# EAGLE board csa_petio_v1.2b (EAGLE 6.4)
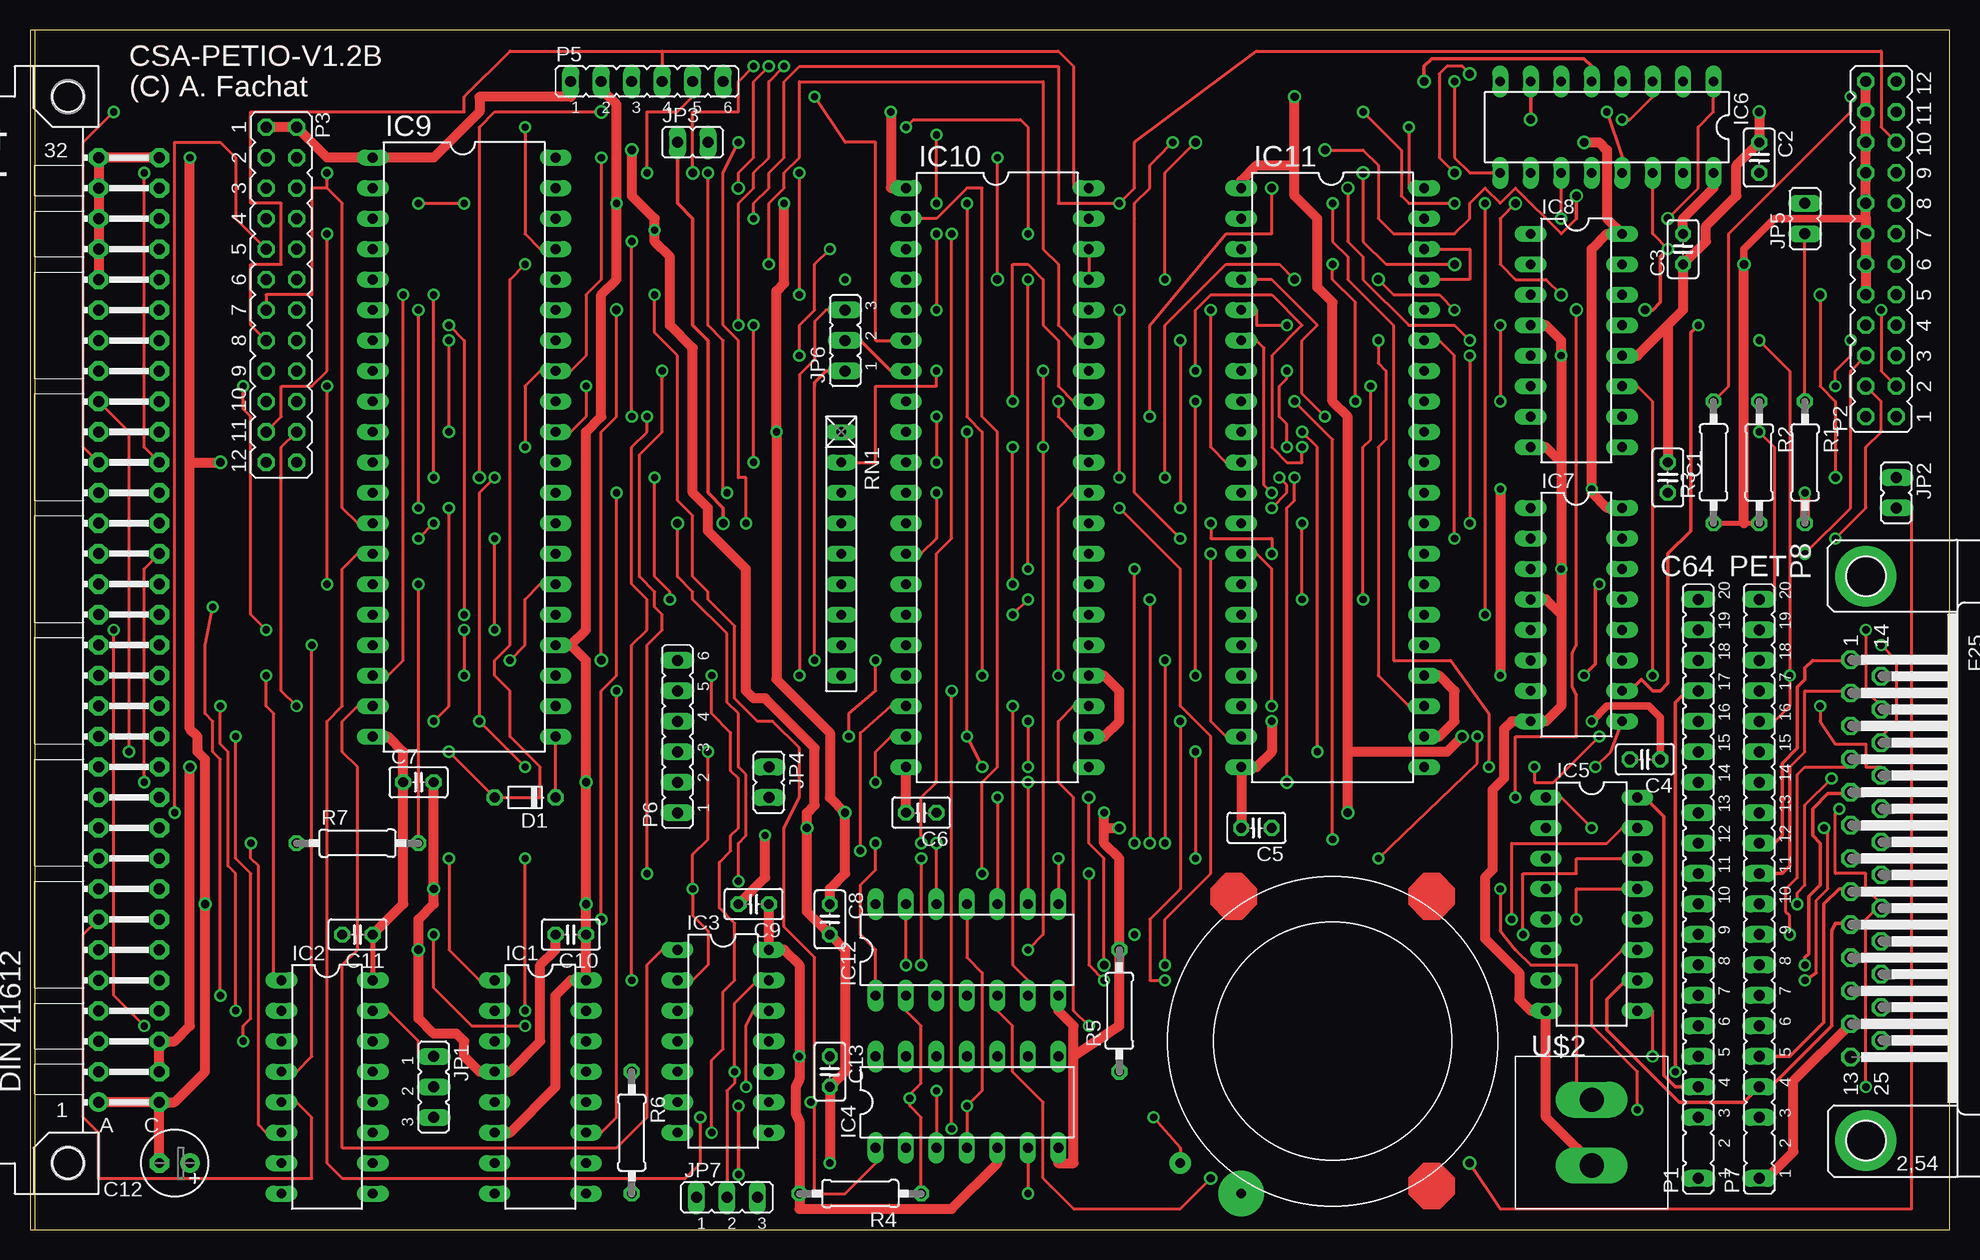
[diagram p2: board, top side]
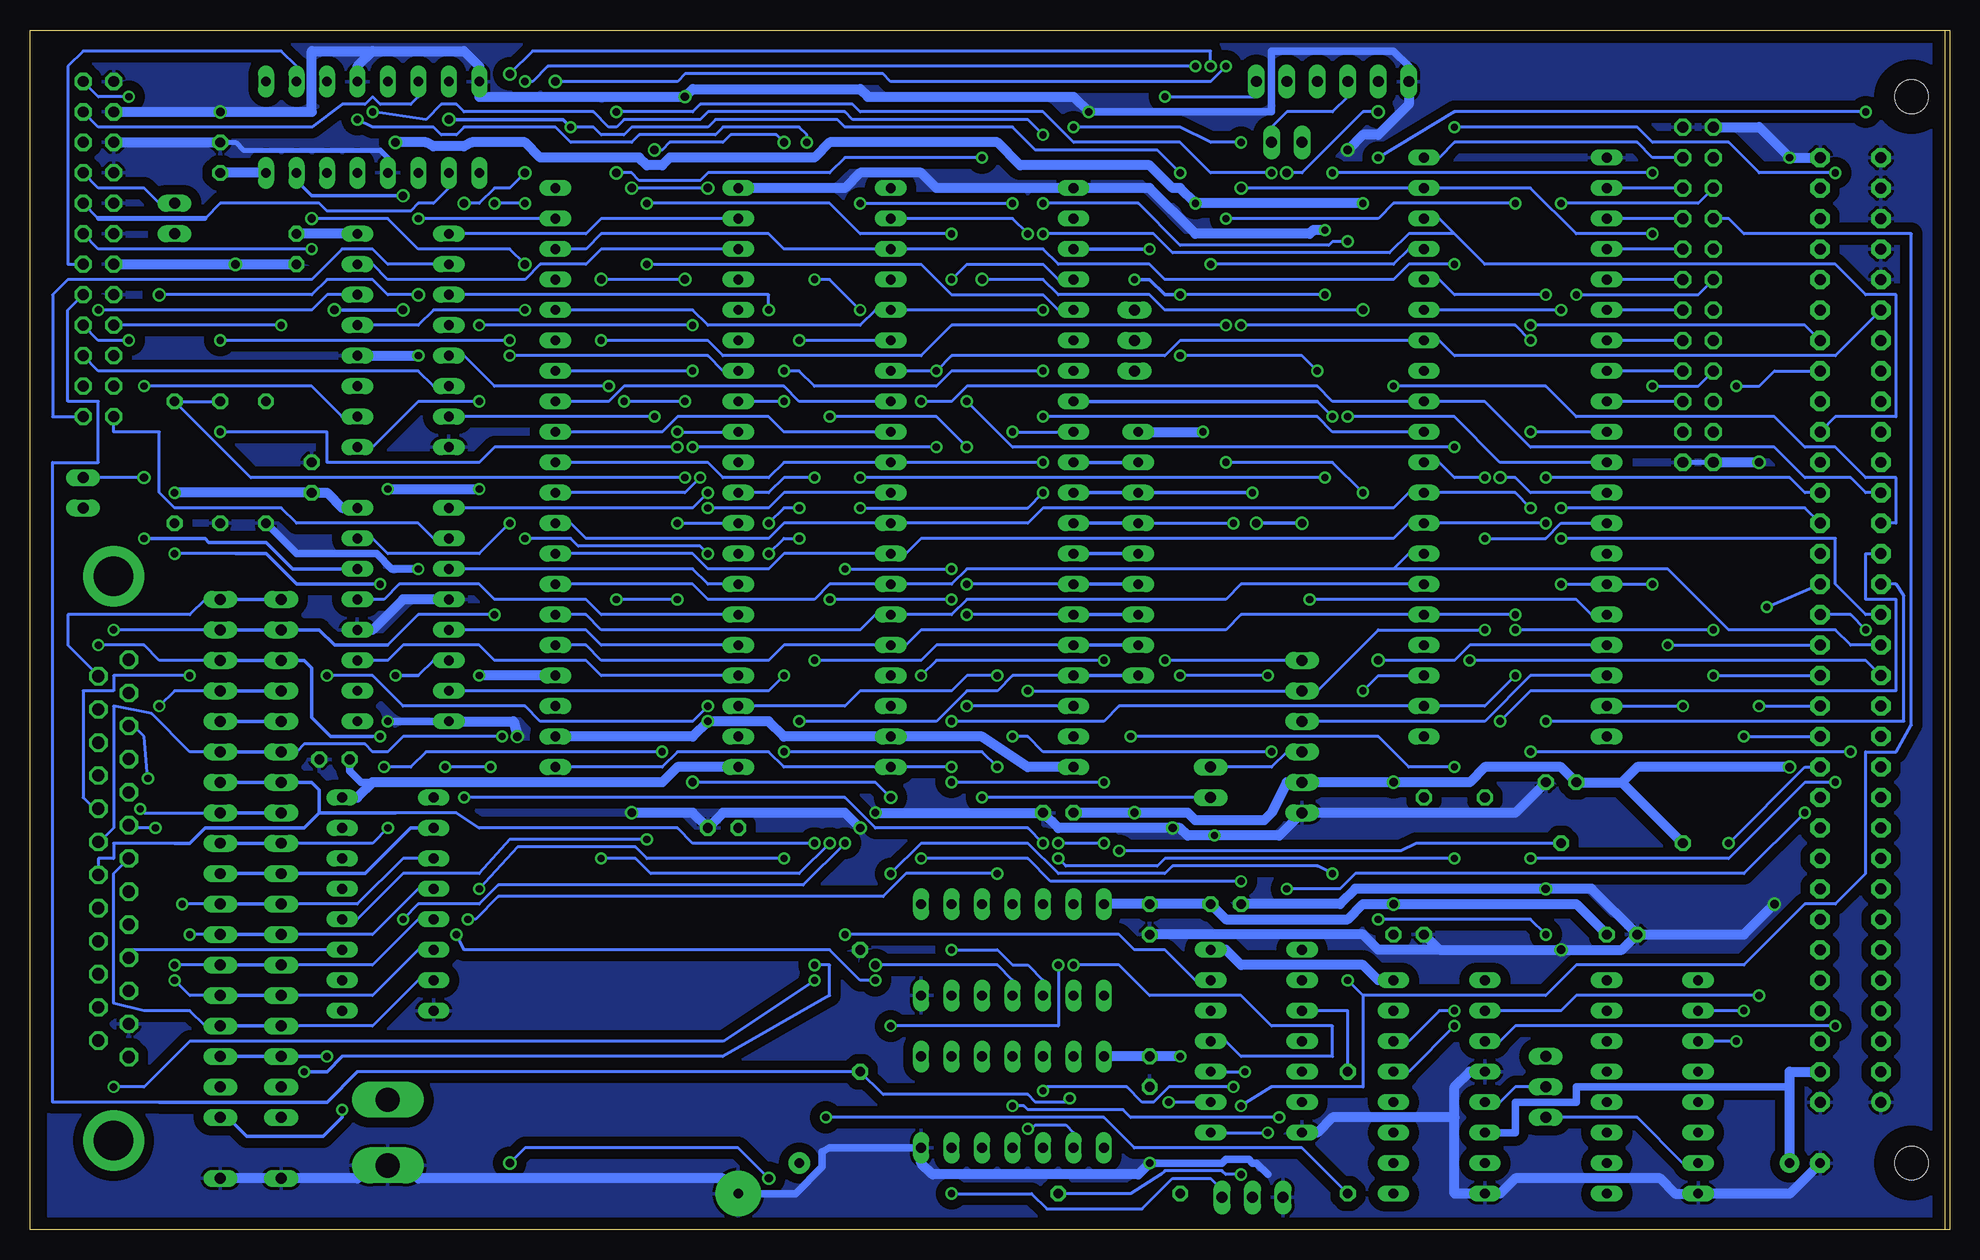
[diagram p3: board, bottom side, seen from below]

Size 160 x 100.03 mm. Coordinates in mm from the lower left corner, seen from the top.
Outline: 0,0.01 160,0.01 160,100.01 0,100.01 0,0.01
Copper layers (1*16): Top 0.035mm / dielectric 1.5mm / Bottom 0.035mm
Design rules "default *": minimum track width 10mil, minimum drill 12mil, track to track 8mil, track to pad 8mil, pad to pad 8mil, via to via 8mil, smd to smd 8mil, copper to edge 40mil, drill to drill 8mil, minimum pad ring 10mil, minimum via ring 8mil, stop-mask expansion 4mil, vias tented up to drill 0mil, thermal gap 10mil

## Footprints (pad centres in the part's own frame; a part is rotated, then mirrored left to right if it is on the bottom)
PIEZOBEEPER = drill 0.8 pad 1.778: 1 -10.16,12.7 | drill 0.8 pad 3.81: 2 -12.7,7.62
C025-025X050 = drill 0.813 octagon: 1 -1.27,0; 2 1.27,0
E2,5-6 = drill 0.813 pad 1.6: + -1.27,0 | drill 0.813 pad 1.6 octagon: - 1.27,0
D-5 = drill 0.813 octagon: A 2.54,0; C -2.54,0
DIL16 = drill 0.813 long: 1 -8.89,-3.81; 2 -6.35,-3.81; 3 -3.81,-3.81; 4 -1.27,-3.81; 5 1.27,-3.81; 6 3.81,-3.81; 7 6.35,-3.81; 8 8.89,-3.81; 9 8.89,3.81; 10 6.35,3.81; 11 3.81,3.81; 12 1.27,3.81; 13 -1.27,3.81; 14 -3.81,3.81; 15 -6.35,3.81; 16 -8.89,3.81
DIL14 = drill 0.813 long: 1 -7.62,-3.81; 2 -5.08,-3.81; 3 -2.54,-3.81; 4 0,-3.81; 5 2.54,-3.81; 6 5.08,-3.81; 7 7.62,-3.81; 8 7.62,3.81; 9 5.08,3.81; 10 2.54,3.81; 11 0,3.81; 12 -2.54,3.81; 13 -5.08,3.81; 14 -7.62,3.81
DIL40 = drill 0.813 long: 1 -16.51,-7.62; 2 -13.97,-7.62; 3 -11.43,-7.62; 4 -8.89,-7.62; 5 -6.35,-7.62; 6 -3.81,-7.62; 7 -1.27,-7.62; 8 1.27,-7.62; 9 3.81,-7.62; 10 6.35,-7.62; 11 8.89,-7.62; 12 11.43,-7.62; 13 13.97,-7.62; 14 16.51,-7.62; 15 19.05,-7.62; 16 21.59,-7.62; 17 24.13,-7.62; 18 26.67,-7.62; 19 29.21,-7.62; 20 31.75,-7.62; 21 31.75,7.62; 22 29.21,7.62; 23 26.67,7.62; 24 24.13,7.62; 25 21.59,7.62; 26 19.05,7.62; 27 16.51,7.62; 28 13.97,7.62; 29 11.43,7.62; 30 8.89,7.62; 31 6.35,7.62; 32 3.81,7.62; 33 1.27,7.62; 34 -1.27,7.62; 35 -3.81,7.62; 36 -6.35,7.62; 37 -8.89,7.62; 38 -11.43,7.62; 39 -13.97,7.62; 40 -16.51,7.62
JP2 = drill 0.914 long: 1 -2.54,0; 2 0,0; 3 2.54,0
JP1 = drill 0.914 long: 1 0,-1.27; 2 0,1.27
C64KEYB = drill 0.914 long: 1 0,0; 3 5.08,0; 4 7.62,0; 5 10.16,0; 6 12.7,0; 7 15.24,0; 8 17.78,0; 9 20.32,0; 10 22.86,0; 11 25.4,0; 12 27.94,0; 13 30.48,0; 14 33.02,0; 15 35.56,0; 16 38.1,0; 17 40.64,0; 18 43.18,0; 19 45.72,0; 20 48.26,0
FLAT24 = drill 0.914 octagon: 1 -13.97,-1.27; 2 -11.43,-1.27; 3 -8.89,-1.27; 4 -6.35,-1.27; 5 -3.81,-1.27; 6 -1.27,-1.27; 7 1.27,-1.27; 8 3.81,-1.27; 9 6.35,-1.27; 10 8.89,-1.27; 11 11.43,-1.27; 12 13.97,-1.27; A -13.97,1.27; B -11.43,1.27; C -8.89,1.27; D -6.35,1.27; E -3.81,1.27; F -1.27,1.27; H 1.27,1.27; J 3.81,1.27; K 6.35,1.27; L 8.89,1.27; M 11.43,1.27; N 13.97,1.27
CSABUS = drill 0.914 pad 1.6: A1 7.62,36.83 | drill 0.914 pad 1.6 octagon: A2 7.62,34.29; A3 7.62,31.75; A4 7.62,29.21; A5 7.62,26.67; A6 7.62,24.13; A7 7.62,21.59; A8 7.62,19.05; A9 7.62,16.51; A10 7.62,13.97; A11 7.62,11.43; A12 7.62,8.89; A13 7.62,6.35; A14 7.62,3.81; A15 7.62,1.27; A16 7.62,-1.27; A17 7.62,-3.81; A18 7.62,-6.35; A19 7.62,-8.89; A20 7.62,-11.43; A21 7.62,-13.97; A22 7.62,-16.51; A23 7.62,-19.05; A24 7.62,-21.59; A25 7.62,-24.13; A26 7.62,-26.67; A27 7.62,-29.21; A28 7.62,-31.75; A29 7.62,-34.29; A30 7.62,-36.83; A31 7.62,-39.37; A32 7.62,-41.91; C1 2.54,36.83; C2 2.54,34.29; C3 2.54,31.75; C4 2.54,29.21; C5 2.54,26.67; C6 2.54,24.13; C7 2.54,21.59; C8 2.54,19.05; C9 2.54,16.51; C10 2.54,13.97; C11 2.54,11.43; C12 2.54,8.89; C13 2.54,6.35; C14 2.54,3.81; C15 2.54,1.27; C16 2.54,-1.27; C17 2.54,-3.81; C18 2.54,-6.35; C19 2.54,-8.89; C20 2.54,-11.43; C21 2.54,-13.97; C22 2.54,-16.51; C23 2.54,-19.05; C24 2.54,-21.59; C25 2.54,-24.13; C26 2.54,-26.67; C27 2.54,-29.21; C28 2.54,-31.75; C29 2.54,-34.29; C30 2.54,-36.83; C31 2.54,-39.37; C32 2.54,-41.91 | hole 2.794: 10.16,41.91; 10.16,-46.99
JP6 = drill 0.914 long: 1 -7.62,1.27; 2 -5.08,1.27; 3 -2.54,1.27; 4 0,1.27; 5 2.54,1.27; 6 5.08,1.27
SUBD25F = drill 1.016 octagon: 1 -14.021,-10.16; 2 -11.252,-10.16; 3 -8.509,-10.16; 4 -5.74,-10.16; 5 -2.972,-10.16; 6 -0.229,-10.16; 7 2.54,-10.16; 8 5.309,-10.16; 9 8.052,-10.16; 10 10.82,-10.16; 11 13.589,-10.16; 12 16.332,-10.16; 13 19.101,-10.16; 14 -12.649,-7.62; 15 -9.881,-7.62; 16 -7.112,-7.62; 17 -4.369,-7.62; 18 -1.6,-7.62; 19 1.168,-7.62; 20 3.912,-7.62; 21 6.68,-7.62; 22 9.449,-7.62; 23 12.192,-7.62; 24 14.961,-7.62; 25 17.729,-7.62 | drill 3.302 pad 5.08: G1 -20.98,-8.89; G2 26.06,-8.89
0207/10 = drill 0.813 octagon: 1 -5.08,0; 2 5.08,0
RN-9 = drill 0.813 long: 1 -10.16,0; 2 -7.62,0; 3 -5.08,0; 4 -2.54,0; 5 0,0; 6 2.54,0; 7 5.08,0; 8 7.62,0; 9 10.16,0
TASTER = drill 2.007 long: 1 0,4.013; 3 0,-1.473

## Placement (x,y rotation side)
BEEP1  PIEZOBEEPERPIEZO  [PIEZOBEEPER]  108.58,15.72 90 top
C1  [C025-025X050]  136.52,62.71 270 top
C2  [C025-025X050]  144.14,89.38 270 top
C3  [C025-025X050]  137.79,81.76 90 top
C4  [C025-025X050]  134.62,39.22 180 top
C5  [C025-025X050]  102.23,33.5 180 top
C6  [C025-025X050]  74.29,34.77 180 top
C7  [C025-025X050]  32.38,37.31 0 top
C8  [C025-025X050]  66.67,25.88 270 top
C9  [C025-025X050]  60.32,27.15 180 top
C10  [C025-025X050]  45.08,24.61 180 top
C11  [C025-025X050]  27.3,24.61 180 top
C12  [E2,5-6]  12.06,5.56 180 top
C13  [C025-025X050]  66.67,13.18 270 top
D1  [D-5]  41.27,36.04 180 top
IC1  74HCT138N  [DIL16]  42.54,11.91 270 top
IC2  74HCT138N  [DIL16]  24.76,11.91 270 top
IC3  74HCT00N  [DIL14]  57.78,15.72 270 top
IC4  74LS86N  [DIL14]  78.1,10.64 0 top
IC5  74LS145N  [DIL16]  130.17,27.15 270 top
IC6  MC3446  [DIL16]  131.44,91.92 180 top
IC7  MC3446  [DIL16]  128.9,51.28 270 top
IC8  MC3446  [DIL16]  128.9,74.14 270 top
IC9  VIA  [DIL40]  36.19,72.87 270 top
IC10  PIA  [DIL40]  80.64,70.33 270 top
IC11  PIA  [DIL40]  108.58,70.33 270 top
IC12  7417N  [DIL14]  78.1,23.34 0 top
JP1  [JP2]  33.65,11.91 270 top
JP2  [JP1]  155.57,61.44 180 top
JP3  [JP1]  55.24,90.65 270 top
JP4  [JP1]  61.59,37.31 180 top
JP5  [JP1]  147.95,84.3 0 top
JP6  [JP2]  67.94,74.14 90 top
JP7  [JP2]  58.1,2.71 0 top
P1  C64KEYB  [C64KEYB]  139.06,4.29 90 top
P2  IEEE488FLATCABLE  [FLAT24]  154.3,81.76 90 top
P3  PETUSERPORT  [FLAT24]  20.95,77.95 270 top
P4  CSABUS  [CSABUS]  13.33,47.47 180 top
P5  CBMTAPE  [JP6]  52.7,94.46 0 top
P6  CBMTAPE  [JP6]  55.24,42.39 90 top
P7  PETKEYBD  [C64KEYB]  144.14,4.29 90 top
P8  PETKEYBDSUBD  [SUBD25F]  161.92,33.5 270 top
R1  2k4  [0207/10]  147.95,63.98 270 top
R2  5k1  [0207/10]  144.14,63.98 270 top
R3  2k4  [0207/10]  140.33,63.98 90 top
R4  2k4  [0207/10]  69.21,3.02 180 top
R5  5k1  [0207/10]  90.8,18.26 90 top
R6  10  [0207/10]  50.16,8.1 270 top
R7  10k  [0207/10]  27.3,32.23 0 top
RN1  10k  [RN-9]  67.62,56.36 270 top
U$2  TASTER  [TASTER]  130.17,6.83 0 top

## Tracks (layer width: path | path; a pad name or v marks a point on that pad's centre or on a via)
//C2MTR  (via drill 0.6)
  Top 0.254: IC4.6 v83.18,3.02
  Bottom 0.254: v83.18,3.02 76.51,3.02 75.24,1.75 67.3,1.75 66.99,2.07 64.77,4.29 61.59,4.29 60.64,3.34 JP7.3
/C1MTR  (via drill 0.6, 0.61)
  Top 0.254: v70.48,37.31 70.48,39.85 71.75,41.12 IC10.19 | v83.18,37.31 IC12.9
  Bottom 0.254: v70.48,37.31 v83.18,37.31
/C2MTR  (via drill 0.6)
  Top 0.254: IC9.14 27.3,56.36 26.03,55.09 26.03,43.66 24.76,42.39 24.76,5.56 26.03,4.29 54.61,4.29 55.88,5.56 v55.88,9.37 | IC4.4 v78.1,10.32 79.37,11.6 79.37,21.44 78.1,22.71 IC12.11
  Bottom 0.254: v55.88,9.37 68.26,9.37 68.89,10.01 76.83,10.01 77.15,10.32 v78.1,10.32
/IOSEL
  Top 0.254: P4.A7 4.44,24.61 4.44,9.37 5.71,8.1 5.71,4.29 23.49,4.29 23.49,9.37 22.22,10.64 IC2.5
/IRQ  (via drill 0.61)
  Top 0.254: IC10.38 IC10.37 | IC11.38 120.01,81.76 120.01,79.22 IC11.37 | v8.25,39.85 8.25,66.52 P4.A24 | v41.27,80.49 40,79.22 40,48.74 38.73,47.47 38.73,46.2 40,44.93 40,41.12 42.54,38.58 42.54,36.04 D1.A v34.92,39.85
  Bottom 0.254: IC11.38 113.66,81.76 112.39,83.03 98.42,83.03 97.15,81.76 IC10.38 75.56,81.76 74.29,80.49 66.67,80.49 65.4,79.22 46.35,79.22 45.08,80.49 v41.27,80.49 | v8.25,39.85 v34.92,39.85
/RES  (via drill 0.61)
  Top 0.254: v83.18,23.34 84.45,24.61 v84.45,65.25 v84.45,71.6 | v104.77,65.25 104.77,67.16 104.13,67.79 104.13,70.33 104.77,70.97 v104.77,71.6
  Bottom 0.254: P4.A27 9.52,72.87 41.27,72.87 42.54,74.14 IC9.34 64.13,74.14 65.4,72.87 83.18,72.87 v84.45,71.6 IC10.34 | v83.18,23.34 79.37,23.34 78.1,22.07 76.83,22.07 75.56,20.8 IC12.3 | v84.45,65.25 v104.77,65.25 | v104.77,71.6 IC11.34
/SEL1  (via drill 0.61)
  Top 0.254: v41.27,18.26 v41.27,30.96 | v74.29,30.96 v74.29,22.07 | v88.26,16.99 86.99,18.26 86.99,36.04 85.72,37.31 85.72,42.39 86.99,43.66 IC10.23
  Bottom 0.254: v41.27,18.26 42.54,18.26 45.08,15.72 IC1.14 | v41.27,30.96 65.4,30.96 66.03,30.33 73.66,30.33 v74.29,30.96 | v74.29,22.07 74.29,16.99 v88.26,16.99
/SEL2  (via drill 0.61)
  Top 0.254: v41.27,16.99 36.83,16.99 33.65,20.17 v33.65,24.61 | v47.62,25.88 47.62,44.93 48.89,46.2 v48.89,61.44 | v60.32,63.98 v60.32,75.41 | v112.39,74.14 112.39,72.24 113.02,71.6 113.02,65.89 112.39,65.25 112.39,46.2 114.93,43.66 IC11.23
  Bottom 0.254: v41.27,16.99 45.08,13.18 IC1.13 | v33.65,24.61 34.92,25.88 v47.62,25.88 | v48.89,61.44 51.43,63.98 v60.32,63.98 | v60.32,75.41 83.18,75.41 85.72,72.87 102.23,72.87 103.5,74.14 v112.39,74.14
/SEL4  (via drill 0.61)
  Top 0.254: v48.89,44.93 48.89,9.37 47.62,8.1 IC1.11
  Bottom 0.254: v48.89,44.93 47.62,46.2 IC9.23
/SRQIN  (via drill 0.61)
  Top 0.254: v78.1,85.57 78.1,67.79 79.37,66.52 v79.37,46.2 | P2.10 154.3,91.92 154.3,98.27 102.23,98.27 92.07,90.65 92.07,86.84 v90.8,85.57 85.72,85.57 85.72,97 64.13,97 62.86,95.73 62.86,89.38 61.59,88.11 61.59,86.84 60.32,85.57 v60.32,84.3 | v32.38,85.57 v36.19,85.57
  Bottom 0.254: v79.37,46.2 81.91,46.2 83.18,44.93 90.8,44.93 92.07,43.66 IC11.18 | v90.8,85.57 v78.1,85.57 | P3.3 20.95,85.57 v32.38,85.57 | v36.19,85.57 46.35,85.57 47.62,84.3 v60.32,84.3
A0  (via drill 0.61)
  Top 0.254: v75.56,83.03 v75.56,76.68
  Bottom 0.254: IC11.36 104.77,76.68 103.5,75.41 90.8,75.41 89.53,76.68 IC10.36 v75.56,76.68 | 41.27,83.03 38.73,80.49 9.52,80.49 6.98,77.95 4.44,77.95 4.44,67.79 9.52,67.79 P4.C23 | 41.27,83.03 42.54,84.3 IC9.38 | 41.27,83.03 45.08,83.03 46.67,81.45 64.77,81.45 66.35,83.03 v75.56,83.03
A1  (via drill 0.61)
  Top 0.254: v61.59,80.49 61.59,85.57 62.86,86.84 62.86,88.11 64.13,89.38 64.13,95.73 84.45,95.73 84.45,81.76 85.72,80.49 85.72,75.41 86.99,74.14 IC10.35 | v118.74,57.63 118.74,72.87 117.47,74.14 IC11.35 | v103.5,56.36 103.5,57.63 98.42,57.63 v98.42,58.9 | v95.88,74.14 v95.88,60.17 | P4.C22 9.52,65.25 v9.52,88.11 | v41.27,91.92 41.27,83.03 42.54,81.76 IC9.37
  Bottom 0.254: IC9.37 45.08,81.76 46.35,80.49 v61.59,80.49 | v118.74,57.63 114.93,57.63 114.3,57 104.13,57 v103.5,56.36 | v98.42,58.9 97.15,60.17 v95.88,60.17 | IC10.35 v95.88,74.14 | v9.52,88.11 15.87,88.11 18.41,90.65 24.76,90.65 26.03,91.92 v41.27,91.92
A2  (via drill 0.61)
  Top 0.254: v33.65,62.71 v33.65,77.95
  Bottom 0.254: v33.65,77.95 41.27,77.95 42.54,79.22 IC9.36 | v33.65,62.71 13.33,62.71 12.06,61.44 P4.C21
A3  (via drill 0.61)
  Top 0.254: v32.38,60.17 v32.38,76.68
  Bottom 0.254: v32.38,60.17 12.06,60.17 P4.C20 | v32.38,76.68 IC9.35
A4  (via drill 0.61)
  Top 0.254: v34.92,30.96 34.92,23.34 37.46,20.8 IC1.1 | v9.52,37.31 9.52,55.09 P4.C19
  Bottom 0.254: v34.92,30.96 18.41,30.96 12.06,37.31 v9.52,37.31
A5  (via drill 0.61)
  Top 0.254: v15.87,19.53 15.87,39.22 15.24,39.85 15.24,42.39 14.6,43.03 14.6,48.74 v15.24,51.92
  Bottom 0.254: v15.87,19.53 31.11,19.53 32.38,18.26 IC1.2 | v15.24,51.92 P4.C18
A6  (via drill 0.61)
  Top 0.254: v9.52,16.99 6.98,19.53 v6.98,50.01
  Bottom 0.254: v9.52,16.99 36.19,16.99 37.46,15.72 IC1.3 | v6.98,50.01 8.25,51.28 P4.C17
A7  (via drill 0.61)
  Top 0.254: v23.49,48.74 23.49,14.45 22.22,13.18 IC2.4
  Bottom 0.254: v23.49,48.74 P4.C16
A8  (via drill 0.61)
  Top 0.254: v19.68,46.2 19.68,43.66 20.31,43.03 20.31,21.44 IC2.1
  Bottom 0.254: v19.68,46.2 P4.C15
A9  (via drill 0.61)
  Top 0.254: v17.14,18.26 17.14,29.69 16.5,30.33 16.5,39.85 15.87,40.49 v15.87,43.66
  Bottom 0.254: v15.87,43.66 P4.C14 | v17.14,18.26 IC2.2
A10  (via drill 0.61)
  Top 0.254: v17.77,15.72 17.77,16.99 18.41,17.63 18.41,29.69 17.14,30.96 v17.14,41.12
  Bottom 0.254: v17.14,41.12 P4.C13 | v17.77,15.72 IC2.3
A11  (via drill 0.61)
  Top 0.254: v18.41,32.23 18.41,30.96 19.04,30.33 19.04,8.74 19.68,8.1 IC2.6
  Bottom 0.254: v18.41,32.23 12.06,38.58 P4.C12
ATN
  Bottom 0.254: P2.11 154.3,91.92 136.52,91.92 133.98,93.83 132.07,93.83 131.44,94.46 130.81,93.83 128.27,93.83 127.63,94.46 IC6.6
ATN/C2SW
  Top 0.305: JP6.2 69.21,74.14 71.75,71.6 IC10.7
ATNA_EN  (via drill 0.6, 0.61)
  Top 0.254: IC3.13 60.64,20.8 58.73,18.9 v58.73,13.18 58.73,12.23 58.1,11.6 JP7.2
  Bottom 0.254: v92.07,24.61 69.21,24.61 67.94,23.34 65.4,23.34 62.86,20.8 IC3.13 | IC3.10 v58.73,13.18
ATNIN  (via drill 0.6, 0.61, 0.7)
  Top 0.254: 65.4,10.32 65.4,3.02 67.94,3.02 70.48,5.56 IC4.1 | 65.4,10.32 65.4,22.71 62.86,25.25 62.86,33.5 64.13,36.04 64.13,40.17 61.91,42.39 60.64,42.39 58.73,44.3 58.73,50.33 56.51,52.55 56.51,53.19 55.24,54.46 55.24,59.54 53.97,60.81 53.97,72.87 52.07,74.78 v52.07,77.95 | v64.13,77.95 v64.13,88.11 | v114.93,91.92 114.93,86.84 IC11.40 | v65.08,10.64 65.4,10.32
  Top 0.305: IC6.7 v125.09,92.56
  Bottom 0.254: v52.07,77.95 v64.13,77.95 | v64.13,88.11 66.03,90.02 76.19,90.02 78.1,91.92 92.07,91.92 92.7,92.56 102.86,92.56 103.5,91.92 109.85,91.92 110.48,91.29 112.39,91.29 113.02,91.92 v114.93,91.92 | IC3.9 v65.08,10.64
  Bottom 0.305: v125.09,92.56 115.56,92.56 v114.93,91.92 | v64.13,77.95 65.4,77.95 66.67,79.22 v67.94,79.22
ATNOUT  (via drill 0.61, 0.7)
  Top 0.254: v37.46,62.71 37.46,91.92 38.73,93.19 v47.62,93.19 | v55.24,88.11 55.24,93.19 59.05,93.19 59.05,95.73 v60.32,97
  Top 0.305: IC6.5 130.17,97 129.53,97.64 116.83,97.64 116.2,97 v116.2,95.73
  Bottom 0.254: v60.32,97 61.59,95.73 88.26,95.73 88.89,96.37 105.41,96.37 106.04,95.73 v116.2,95.73 | IC9.12 34.92,61.44 36.19,62.71 v37.46,62.71 | v47.62,93.19 48.89,93.19 53.97,88.11 v55.24,88.11
C1MTR
  Bottom 0.254: P5.3 50.16,94.46 51.43,93.19 55.24,93.19 56.51,91.92 JP3.2
C1RD
  Top 0.254: 52.7,98.27 85.72,98.27 86.99,97 86.99,86.84 IC10.40 | 52.7,98.27 P5.4 | P3.8 18.41,75.41 18.41,80.49 20.95,80.49 20.95,85.57 18.41,85.57 18.41,93.19 36.19,93.19 36.19,94.46 40,98.27 52.7,98.27
C1SW  (via drill 0.61)
  Top 0.254: IC10.6 70.48,74.14 70.48,90.65 67.94,90.65 v65.4,94.46
  Bottom 0.254: v65.4,94.46 57.78,94.46 P5.6
C2MTR
  Bottom 0.254: P6.3 55.24,39.85 56.51,38.58 JP4.1
C2RD  (via drill 0.61)
  Top 0.254: v31.11,77.95 31.11,47.47 29.84,46.2 IC9.18
  Bottom 0.254: IC9.18 34.92,46.2 38.73,42.39 P6.4 | P3.6 20.95,77.95 v31.11,77.95
C2SW  (via drill 0.61)
  Top 0.254: v65.4,47.47 65.4,70.33
  Top 0.305: 65.4,70.33 65.4,70.65 66.35,71.6 JP6.1
  Bottom 0.254: P6.6 v65.4,47.47
CWR  (via drill 0.6, 0.61)
  Top 0.254: v76.83,8.42 v76.83,44.93 | 24.76,86.84 26.03,85.57 26.03,60.17 27.3,58.9 IC9.13 | 24.76,86.84 23.49,86.84 23.49,77.95 19.68,77.95 P3.7 | 24.76,86.84 v24.76,88.11 | v51.43,88.11 51.43,93.19 53.97,93.19 55.24,94.46 P5.5 | v38.73,50.01 v38.73,57.63
  Bottom 0.254: v76.83,44.93 P6.5 52.7,44.93 47.62,50.01 v38.73,50.01 | v24.76,88.11 v51.43,88.11 | v38.73,57.63 33.65,57.63 32.38,58.9 IC9.13 | v76.83,8.42 76.51,8.42 76.19,8.74 73.66,8.74 73.02,8.1 IC4.2
D0  (via drill 0.61)
  Top 0.254: v47.62,89.38 47.62,79.22 46.35,77.95 46.35,72.87 45.08,71.6 IC9.33 42.54,71.6 41.27,70.33 v41.27,65.25 | v6.98,93.19 4.44,90.65 4.44,65.25 P4.A22 | v81.91,69.06 81.91,80.49 83.18,80.49 84.45,79.22 84.45,75.41 85.72,74.14 85.72,70.33 86.99,69.06 IC10.33
  Bottom 0.254: IC10.33 95.88,69.06 97.15,70.33 110.48,70.33 111.75,69.06 IC11.33 | v47.62,89.38 41.27,93.19 v6.98,93.19 | v81.91,69.06 78.1,65.25 v41.27,65.25
D1  (via drill 0.61)
  Top 0.254: v85.72,69.06 85.72,67.79 86.99,66.52 IC10.32
  Bottom 0.254: IC10.32 97.15,66.52 98.42,67.79 106.04,67.79 107.31,66.52 IC11.32 | P4.A21 6.98,61.44 8.25,62.71 12.06,62.71 14.6,65.25 34.92,65.25 38.73,69.06 IC9.32 51.43,69.06 52.7,70.33 81.91,70.33 83.18,69.06 v85.72,69.06
D2  (via drill 0.61)
  Top 0.254: v46.35,70.33 46.35,67.79 45.08,66.52 IC9.31 | v75.56,67.79 v75.56,63.98
  Bottom 0.254: IC11.31 103.5,63.98 102.23,62.71 98.42,62.71 97.15,63.98 IC10.31 v75.56,63.98 | v46.35,70.33 33.65,70.33 31.11,67.79 14.6,67.79 12.06,65.25 9.52,65.25 6.98,62.71 4.44,62.71 4.44,58.9 P4.A20 | v75.56,67.79 52.7,67.79 51.43,66.52 IC9.31
D3  (via drill 0.61)
  Top 0.254: v103.5,60.17 104.77,61.44 104.77,62.08 v104.13,62.71 | v38.73,62.71 37.46,61.44 v37.46,42.39 v41.27,38.58 | v85.72,46.2 85.72,60.17 86.99,61.44 IC10.30 | v70.48,47.47 70.48,44.93 68.26,43.03 v68.26,41.12
  Bottom 0.254: v103.5,60.17 98.42,60.17 97.15,61.44 IC10.30 | v104.13,62.71 105.41,61.44 IC11.30 | v38.73,62.71 41.27,62.71 42.54,63.98 IC9.30 | v37.46,42.39 34.92,44.93 4.44,44.93 4.44,52.55 6.98,52.55 6.98,56.36 P4.A19 | v85.72,46.2 84.45,47.47 v70.48,47.47 | v68.26,41.12 47.62,41.12 45.08,38.58 v41.27,38.58
D4  (via drill 0.61)
  Top 0.254: v33.65,42.39 34.92,43.66 v34.92,60.17
  Bottom 0.254: IC11.29 114.93,58.9 113.66,57.63 98.42,57.63 97.15,58.9 IC10.29 76.83,58.9 75.56,60.17 46.35,60.17 45.08,61.44 IC9.29 36.19,61.44 v34.92,60.17 | P4.A18 4.44,53.82 3.8,52.87 3.8,42.39 v33.65,42.39
D5  (via drill 0.61)
  Top 0.254: v32.38,57.63 v33.65,58.9
  Bottom 0.254: IC11.28 104.77,56.36 103.5,55.09 98.42,55.09 97.15,56.36 IC10.28 86.99,56.36 85.72,57.63 46.35,57.63 45.08,58.9 IC9.28 v33.65,58.9 | P4.A17 6.98,51.28 9.52,53.82 9.52,57.63 v32.38,57.63
D6
  Bottom 0.254: 46.35,55.09 45.08,56.36 IC9.27 | 46.35,55.09 81.91,55.09 83.18,53.82 IC10.27 93.34,53.82 94.61,52.55 103.5,52.55 104.77,53.82 IC11.27 | P4.A16 8.25,48.74 9.52,50.01 18.41,50.01 23.49,55.09 46.35,55.09
D7  (via drill 0.61)
  Top 0.254: v40,47.47 41.27,48.74 41.27,52.55 42.54,53.82 IC9.26
  Bottom 0.254: IC11.26 113.66,51.28 112.39,50.01 90.8,50.01 89.53,51.28 IC10.26 83.18,51.28 81.91,52.55 60.32,52.55 59.05,53.82 IC9.26 | P4.A15 6.98,47.47 v40,47.47
DAV
  Bottom 0.254: P2.6 156.84,80.49 156.84,97 155.57,98.27 139.06,98.27 137.79,97 IC6.2
DAVIN  (via drill 0.61, 0.7)
  Top 0.254: IC6.1 140.33,93.19 139.06,91.92 139.06,86.84 v136.52,84.3 | v118.74,80.49 113.02,80.49 111.12,82.4 v111.12,88.11 | v47.62,47.47 47.62,66.52 48.89,67.79 v48.89,76.68 | v80.64,79.22 v80.64,89.38
  Bottom 0.254: v136.52,84.3 130.17,84.3 127.63,81.76 120.01,81.76 v118.74,80.49 | v111.12,88.11 109.85,88.11 109.21,87.48 104.13,87.48 103.5,88.11 93.34,88.11 92.07,89.38 v80.64,89.38 | IC9.17 40,48.74 41.27,47.47 v47.62,47.47 | v48.89,76.68 65.4,76.68 66.67,77.95 74.29,77.95 75.56,79.22 v80.64,79.22
DAVOUT  (via drill 0.61)
  Top 0.254: v98.42,56.36 98.42,42.39 99.69,41.12 IC11.19 | v95.88,57.63 92.07,61.44 92.07,84.3 92.07,85.57 93.34,86.84 93.34,88.75 93.97,89.38 v95.24,90.65 | v132.71,92.56 133.34,92.56 135.25,94.46 IC6.3
  Bottom 0.254: v98.42,56.36 97.15,57.63 v95.88,57.63 | v95.24,90.65 95.24,91.29 95.88,91.92 102.23,91.92 102.86,91.29 109.21,91.29 109.85,90.65 114.93,90.65 116.2,91.92 123.82,91.92 124.45,91.29 125.72,91.29 126.36,91.92 131.44,91.92 v132.71,92.56
DEC0  (via drill 0.61)
  Top 0.254: v130.17,33.5 127.63,36.04 IC5.1 | 148.59,47.47 151.76,47.47 P8.1
  Top 0.305: P7.12 145.41,32.23 146.04,32.87 146.04,38.9 147.31,40.17 147.31,45.25 147.95,45.89 147.95,46.84 148.59,47.47
  Bottom 0.254: v130.17,33.5 131.44,32.23 P1.12
  Bottom 0.305: P7.12 P1.12
DEC1
  Top 0.254: 146.68,38.58 147.95,39.85 147.95,44.93 151.76,44.93 P8.2
  Top 0.305: 146.68,38.58 146.68,30.33 146.04,29.69 P7.11
  Bottom 0.305: P7.11 P1.11 132.07,29.69 128.27,33.5 IC5.2
DEC2  (via drill 0.61)
  Top 0.254: v147.31,27.15 147.31,28.1 147.95,28.74 147.95,35.41 v150.17,37.63
  Bottom 0.254: IC5.3 128.9,30.96 132.71,27.15 P1.10 | v150.17,37.63 150.49,41.12 151.76,42.39 P8.3 | P7.10 v147.31,27.15
  Bottom 0.305: P7.10 P1.10
DEC3  (via drill 0.61)
  Top 0.254: v146.68,24.61 146.68,26.2 146.36,26.52 146.36,28.42 147.31,29.37 147.31,37.95 147.95,38.58 151.76,38.58 P8.4
  Bottom 0.254: IC5.4 127.63,28.42 131.44,24.61 P1.9 | P7.9 v146.68,24.61
  Bottom 0.305: P7.9 P1.9
DEC4  (via drill 0.61)
  Top 0.305: v147.95,22.07 147.95,22.71 148.27,23.03 148.27,27.79 149.22,28.74 149.22,32.23 148.59,32.87 148.59,35.09 149.85,36.36 151.65,36.36 P8.5
  Bottom 0.254: IC5.5 127.63,25.88 131.44,22.07 P1.8 | P7.8 v147.95,22.07
  Bottom 0.305: P7.8 P1.8
DEC5  (via drill 0.61)
  Top 0.254: v149.54,33.5 149.85,33.19 149.85,28.42 148.9,27.47 148.9,21.44 v147.95,20.8
  Bottom 0.254: IC5.6 127.63,23.34 131.44,19.53 P1.7 | v149.54,33.5 151.76,33.5 P8.6 | v147.95,20.8 146.68,19.53 P7.7
  Bottom 0.305: P7.7 P1.7
DEC6
  Bottom 0.254: IC5.7 127.63,20.8 131.44,16.99 P1.6 | P8.7 153.03,29.69 153.03,18.9 150.49,18.26 146.68,18.26 145.41,16.99 P7.6
  Bottom 0.305: P7.6 P1.6
DEC7  (via drill 0.61)
  Top 0.254: v135.25,14.45 135.25,18.26 IC5.9
  Top 0.305: P7.5 146.68,14.45 149.54,17.31 149.54,27.15 150.81,28.42 151.53,28.42 P8.8
  Bottom 0.254: 151.76,28.42 P8.8
  Bottom 0.305: P7.5 P1.5 v135.25,14.45
DEC8
  Top 0.305: IC5.10 133.03,20.8 131.44,19.22 131.44,16.67 137.47,10.64 142.87,10.64 P7.4 145.09,11.91 150.17,16.99 150.17,24.93 150.49,25.56 151.65,25.56 P8.9
  Bottom 0.254: 151.76,25.88 P8.9
DEC9  (via drill 0.61)
  Top 0.254: v133.98,10.01 133.98,13.18 130.17,16.99 130.17,20.8 132.71,23.34 IC5.11
  Bottom 0.254: P8.10 151.76,23.34 IC5.11
  Bottom 0.305: P7.3 143.5,9.37 141.92,7.79 135.57,7.79 133.98,9.37 v133.98,10.01
DI1
  Bottom 0.254: IC11.2 112.39,84.3 113.66,83.03 IC8.1
DI2
  Bottom 0.254: IC11.3 112.39,81.76 113.66,80.49 117.47,80.49 118.74,79.22 130.17,79.22 131.44,80.49 IC8.15
DI3  (via drill 0.61)
  Top 0.254: v107.94,67.79 106.04,69.7 106.04,74.14 107.31,75.41 103.5,79.22 IC11.4
  Bottom 0.254: v107.94,67.79 IC8.7
DI4  (via drill 0.61)
  Top 0.254: v122.55,75.41 v122.55,69.06 | v104.77,75.41 102.23,75.41 102.23,76.68 IC11.5
  Bottom 0.254: v122.55,69.06 127.63,69.06 131.44,65.25 IC8.9 | v104.77,75.41 v122.55,75.41
DI5  (via drill 0.61)
  Top 0.254: v103.5,61.44 102.86,62.08 102.86,73.51 102.23,74.14 IC11.6
  Bottom 0.254: v103.5,61.44 104.77,60.17 IC7.1
DI6  (via drill 0.61)
  Top 0.254: v120.01,72.87 v120.01,58.9
  Bottom 0.254: v120.01,72.87 103.5,72.87 102.23,71.6 IC11.7 | v120.01,58.9 122.55,56.36 130.17,56.36 131.44,57.63 IC7.15
DI7  (via drill 0.61)
  Top 0.254: v97.15,46.2 v97.15,69.06
  Bottom 0.254: v97.15,46.2 98.42,44.93 IC7.7 | v97.15,69.06 IC11.8
DI8  (via drill 0.61)
  Top 0.254: v106.04,66.52 107.31,65.25 v107.31,39.85 | v130.49,38.58 131.76,39.85 IC7.9
  Bottom 0.254: v107.31,39.85 126.99,39.85 128.27,38.58 v130.49,38.58 | v106.04,66.52 IC11.9
DIAG  (via drill 0.61)
  Top 0.254: v56.51,39.85 56.51,32.55 55.24,31.28 v55.24,28.42 55.24,26.2 56.51,24.93 56.51,22.07 55.24,20.8 IC3.2 | v78.1,66.52 v78.1,41.12 v79.37,38.58 | P3.5 17.14,84.3 17.14,89.38 15.87,90.65 12.06,90.65 v12.06,34.77 | v122.55,28.42 122.55,24.93 123.82,23.34 125.09,22.07 128.9,22.07 128.9,11.91 U$2.1 | v97.15,39.85 v97.15,30.96
  Bottom 0.254: v56.51,39.85 75.56,39.85 76.83,41.12 v78.1,41.12 | v78.1,66.52 IC10.9 | v12.06,34.77 17.14,29.69 49.53,29.69 50.8,28.42 v55.24,28.42 | v122.55,28.42 119.38,31.92 109.53,31.92 108.58,30.96 v97.15,30.96 | v97.15,39.85 80.64,39.85 v79.37,38.58
DIO1
  Bottom 0.254: P2.1 158.11,67.79 158.11,77.95 156.84,79.22 136.52,79.22 133.98,81.76 131.44,81.76 130.17,80.49 IC8.2
DIO2  (via drill 0.61)
  Top 0.254: v154.3,76.68 154.3,71.6 P2.2
  Bottom 0.254: v154.3,76.68 136.52,76.68 135.25,77.95 IC8.14
DIO3
  Bottom 0.254: P2.3 154.3,71.6 127.63,71.6 126.36,70.33 IC8.6
DIO4  (via drill 0.61)
  Top 0.254: v150.49,70.33 150.49,71.6 151.76,72.87 v151.76,74.14
  Bottom 0.254: v150.49,70.33 136.52,70.33 133.98,67.79 IC8.10 | v151.76,74.14 154.3,74.14 P2.4
DIO5
  Bottom 0.254: P2.A 153.03,66.52 149.22,66.52 149.22,61.44 147.95,60.17 139.06,60.17 137.79,58.9 127.63,58.9 126.36,57.63 IC7.2
DIO6  (via drill 0.61)
  Top 0.254: v150.49,57.63 153.03,60.17 153.03,65.25 154.3,66.52 154.3,69.06 P2.B
  Bottom 0.254: IC7.14 133.98,55.09
  Bottom 0.305: 133.98,55.09 138.11,55.09 140.33,57.32 145.09,57.32 145.41,57.63 v150.49,57.63
DIO7  (via drill 0.6, 0.61)
  Top 0.254: v147.95,56.36 151.76,60.17 151.76,71.6 P2.C
  Top 0.305: v129.53,46.2 130.49,47.15 130.49,53.51 v130.81,53.82
  Bottom 0.254: 127.63,46.2 126.36,47.47 IC7.6 | 142.87,56.36 v147.95,56.36
  Bottom 0.305: 127.63,46.2 v129.53,46.2 | v130.81,53.82 137.79,53.82 140.33,56.36 142.87,56.36
DIO8  (via drill 0.61)
  Top 0.305: IC7.10 133.34,44.93 134.3,45.89 135.25,44.93 135.88,44.93 136.52,45.57 136.52,56.36 138.42,58.27 138.42,74.78 v139.06,75.41
  Bottom 0.254: v139.06,75.41 P2.D
DO1  (via drill 0.61)
  Top 0.254: v98.42,76.68 98.42,65.25 99.69,63.98 IC11.10
  Bottom 0.254: v98.42,76.68 98.42,77.95 IC8.3
DO2  (via drill 0.61, 0.7)
  Top 0.254: v94.61,62.71 94.61,75.41 99.69,80.49 104.13,80.49 v105.41,79.22 | v112.39,79.22 113.66,77.95 117.47,77.95 v118.74,76.68
  Bottom 0.254: v94.61,62.71 97.15,62.71 98.42,61.44 IC11.11 | v118.74,76.68 126.36,76.68 127.63,75.41 IC8.13 | v105.41,79.22 v112.39,79.22
DO3  (via drill 0.61)
  Top 0.254: v106.04,52.55 v106.04,58.9 | v111.12,52.55 111.12,65.25 111.75,65.89 v111.75,70.33
  Bottom 0.254: v106.04,52.55 v111.12,52.55 | v111.75,70.33 121.28,70.33 123.82,72.87 IC8.5 | v106.04,58.9 IC11.12
DO4  (via drill 0.61)
  Top 0.254: v103.5,43.66 103.5,55.09 102.23,56.36 IC11.13 | v135.25,46.2 135.25,69.06 133.98,70.33 IC8.11
  Bottom 0.254: v103.5,43.66 104.77,42.39 117.47,42.39 118.74,43.66 128.9,43.66 131.44,46.2 v135.25,46.2
DO5
  Bottom 0.254: IC11.14 103.5,53.82 104.77,55.09 IC7.3
DO6
  Bottom 0.254: IC11.15 112.39,51.28 113.66,52.55 121.28,52.55 122.55,53.82 129.22,53.82 130.49,52.55 IC7.13
DO7
  Bottom 0.254: IC11.16 112.39,48.74 113.66,50.01 IC7.5
DO8
  Bottom 0.254: IC11.17 112.39,46.2 113.66,47.47 121.28,47.47 122.55,48.74 128.9,48.74 130.17,47.47 IC7.11
EOI  (via drill 0.6, 0.61)
  Top 0.254: v50.16,20.8 50.16,48.74 51.43,50.01 51.43,52.55 50.16,53.82 50.16,65.25 51.43,66.52 v51.43,67.79 | R4.1 74.29,9.37 73.34,10.32 v73.34,10.96 73.34,11.28 74.29,12.23 74.29,16.99 73.02,18.26 IC12.2
  Top 0.305: v59.05,10.32 v59.05,4.61
  Bottom 0.254: v59.05,10.32 56.51,11.91 48.89,11.91 48.89,19.53 | 48.89,19.53 33.65,19.53 31.11,22.07 17.14,22.07 12.06,27.15 9.52,27.15 6.98,29.69 6.98,39.85 4.44,39.85 3.17,42.08 3.17,83.03 17.14,83.03 18.41,84.3 P3.4 | v51.43,67.79 52.7,69.06 | 48.89,19.53 v50.16,20.8 | v73.34,10.96 73.66,10.64 76.19,10.64 76.83,11.28 88.89,11.28 R5.1 132.71,13.18 | v59.05,4.61 60.32,4.61 60.64,4.93 65.4,4.93 65.72,4.61 68.26,3.02 R4.1 | P2.5 156.84,76.68 156.84,69.06 154.3,69.06 154.3,63.98 158.11,63.98 158.11,10.64 149.22,10.64
  Bottom 0.305: 52.7,69.06 IC10.8 | 149.22,10.64 135.25,10.64 132.71,13.18
EOIOUT  (via drill 0.61)
  Top 0.254: v70.48,32.23 70.48,30.01 69.21,28.74 69.21,24.61 70.48,23.34 IC12.1 | v74.29,32.23 74.29,36.04 75.56,37.31 75.56,56.36 76.83,57.63 v76.83,83.03
  Bottom 0.254: v70.48,32.23 v74.29,32.23 | v76.83,83.03 78.1,84.3 IC10.39
GND  (via drill 0.6, 0.61, 0.7)
  Top 0.406: R2.2 142.87,58.9 R3.1
  Top 0.61: v142.87,80.49 142.87,81.76 145.41,84.3 153.03,84.3 | C4.1 135.88,42.71 134.93,43.66 131.44,43.66 v130.17,42.39
  Top 0.813: P4.C1 P4.A1 | C12.- P4.C1 | IC4.7 85.72,5.56 86.99,5.56 86.99,14.45 | 86.99,14.45 86.99,16.99 85.72,18.26 IC12.7 | 86.99,14.45 90.8,16.99 R5.2 90.8,30.96 89.53,32.23 89.53,33.5 | v66.67,5.56 C13.2 67.94,13.18 67.94,23.34 C8.2 64.77,26.52 v64.77,33.5 64.77,34.77 65.4,35.41 65.4,40.17 61.27,44.3 60.32,44.3 59.69,44.93 59.69,55.09 56.51,58.27 56.51,60.17 55.24,61.44 55.24,73.51 53.34,75.41 53.34,81.13 52.07,82.4 v52.07,83.35 52.07,84.3 50.16,86.21 v50.16,90.02 | 127.63,51.28 127.63,43.66 126.36,42.39 IC7.8 123.5,42.39 122.87,41.76 122.87,37.63 121.91,36.68 121.91,30.01 121.28,29.37 121.28,24.29 124.14,21.44 124.14,19.22 125.09,18.26 IC5.8 126.36,9.37 128.9,6.83 U$2.3 | 127.63,51.28 126.36,52.55 IC7.4 | 127.63,63.98 126.36,65.25 IC8.8 | 127.63,63.98 v127.63,55.09 127.63,51.28 | 127.63,63.98 v127.63,72.87 127.63,74.14 126.36,75.41 IC8.4 | 136.52,75.41 137.79,76.68 C3.1 139.69,82.4 139.69,83.67 142.23,86.21 142.23,88.75 C2.1 v144.14,93.19 | 136.52,75.41 133.98,72.87 IC8.12 | 136.52,75.41 C1.1 | P2.N P2.M P2.L P2.K P2.J 153.03,84.3 P2.H P2.F P2.E | 142.87,58.9 v142.87,80.49 | P3.1 P3.A 24.76,89.38 IC9.1 33.65,89.38 37.46,93.19 37.46,94.46 45.08,94.46 P5.1 | P4.A28 P4.A29 P4.A30 P4.A31 P4.A32 P4.C32 | v71.75,93.19 71.75,86.84 IC10.1 | C7.2 v33.65,28.42 33.65,27.15 32.38,25.88 v32.38,23.34 32.38,17.63 33.65,16.36 35.55,16.36 36.19,15.72 36.19,14.45 37.46,13.18 IC1.4 40,13.18 42.54,15.72 42.54,22.07 43.81,23.34 C10.2 | 89.53,33.5 v89.53,34.77 | 89.53,33.5 v90.8,33.5 | P4.C1 12.06,10.64 14.6,13.18 v14.6,27.15 14.6,39.22 13.97,39.85 13.97,41.12 13.33,41.76 13.33,63.98
  Top 0.813: 13.33,63.98 v13.33,89.38 | 13.33,63.98 v15.87,63.98 | v109.85,34.77 109.85,39.85 | 109.85,39.85 109.85,67.79 108.58,69.06 108.58,77.32 107.31,78.59 107.31,84.3 105.41,86.21 105.41,88.75 | 105.41,88.75 v105.41,94.46 | IC11.1 100.96,87.48 102.23,88.75 105.41,88.75 | v119.38,41.12 118.1,39.85 109.85,39.85 | P7.1 144.78,4.29 147,6.51 147,12.41 P8.12 | C9.2 61.27,29.37 v61.27,32.87
  Bottom 0.254: 151.76,16.99 P8.12
  Bottom 0.406: C2.1 142.87,90.65 142.23,90.02 130.81,90.02 130.17,89.38 IC6.12 | P3.12 P3.N
  Bottom 0.61: IC4.7 93.34,6.83 93.97,6.51 93.97,5.25 96.2,3.02 BEEP1.2 | v71.75,93.19 56.51,93.19 56.51,98.27 46.35,98.27 45.08,97 P5.1 | v130.17,42.39 IC7.8 | v127.63,55.09 129.85,55.09 131.12,56.36 137.79,56.36 R3.1 | v66.67,5.56 60.64,5.56 60.32,5.88 58.41,5.88 58.1,5.56 57.78,5.56 56.83,4.61
  Bottom 0.813: C12.- 13.33,3.02 IC2.8 22.86,3.02 24.12,4.29 36.19,4.29 37.46,3.02 IC1.8 41.27,3.02 41.27,9.37 | 41.27,9.37 41.27,11.91 40,13.18 IC1.4 | 41.27,9.37 51.43,9.37 52.7,8.1 IC3.7 | C7.2 36.19,34.77 P6.1 55.88,32.87 v61.27,32.87 63.5,32.87 64.13,33.5 v64.77,33.5 74.29,33.5 C6.1 v89.53,34.77 | C11.2 27.3,23.34 v32.38,23.34 42.54,23.34 | C10.2 42.54,23.34 | C9.2 50.8,27.15 49.53,28.42 v33.65,28.42 29.84,28.42 C11.2 | C8.2 48.89,24.61 47.62,23.34 42.54,23.34 | v66.67,5.56 67.62,4.61 84.77,4.61 85.72,5.56 IC4.7 | IC7.4 128.9,52.55 131.44,50.01 IC7.12 133.34,50.01 | P2.L C2.1 | P2.F v142.87,80.49 C3.1 | IC8.12 v127.63,72.87 | P4.C32 v13.33,89.38 15.87,91.92 P3.1 | 131.44,98.27 123.82,98.27 122.55,97 IC6.8 122.55,94.46 v105.41,94.46 104.77,95.1 90.8,95.1 90.16,94.46 73.02,94.46 v71.75,93.19 | 131.44,98.27 132.71,97 IC6.4 | IC11.1 92.07,86.84 90.8,88.11 85.72,88.11 84.45,86.84 IC10.1 66.67,86.84 62.86,83.03 53.34,83.03 53.02,83.35 v52.07,83.35 | P2.M v144.14,93.19 136.52,93.19 136.52,98.27 131.44,98.27 | BEEP1.2 102.23,4.29 127.63,4.29 U$2.3 132.71,4.29 P1.1 P7.1 | v109.85,34.77 104.77,34.77 C5.1 102.23,34.77 92.07,34.77 v90.8,33.5 | v15.87,63.98 P3.12 | C11.2 17.14,24.61 v14.6,27.15 | P5.1 45.08,93.83 47.62,91.29 48.89,91.29 v50.16,90.02 | IC7.8 119.69,42.39 v119.38,41.12
  pour Bottom (isolate 0.813): 1.27,98.91 158.43,98.91 158.43,1.12 1.27,1.12
GRAPHIC  (via drill 0.61, 0.7)
  Top 0.254: v24.76,83.03 24.76,71.6 23.49,70.33 20.95,70.33 20.95,67.79 P3.11 | v150.49,62.71 150.49,69.06 149.22,70.33 v149.22,77.95 | v127.63,77.95 126.36,79.22 123.82,79.22 122.55,80.49 122.55,84.3 v123.82,85.57 | v118.74,88.11 117.47,89.38 117.47,95.73 117.47,96.37 118.1,97 119.38,97 v120.01,96.37 | v59.05,86.84 59.05,88.11 60.32,89.38 60.32,95.73 v61.59,97
  Bottom 0.254: v24.76,83.03 31.11,83.03 34.92,86.84 IC9.39 v59.05,86.84 | v150.49,62.71 JP2.1 | v149.22,77.95 136.52,77.95 135.25,79.22 131.44,79.22 130.17,77.95 v127.63,77.95 | v123.82,85.57 122.55,85.57 121.28,86.84 120.01,86.84 v118.74,88.11 | v120.01,96.37 118.1,98.27 61.59,98.27 v61.59,97
IECRES  (via drill 0.61, 0.7)
  Top 0.254: v104.77,37.31 104.77,60.17 105.41,60.81 v105.41,62.71 | R1.1 JP5.1 | v88.26,36.04 88.26,32.23 89.53,30.96 v89.53,22.07
  Bottom 0.254: v105.41,62.71 141.6,62.71 R1.1 R2.1 | IC12.4 78.1,20.8 79.37,22.07 v89.53,22.07 | v104.77,37.31 89.53,37.31 v88.26,36.04
IFC
  Bottom 0.254: P2.9 154.3,86.84 150.49,86.84 149.22,85.57 JP5.2
KI0  (via drill 0.61)
  Top 0.254: RN1.2 70.48,63.98 70.48,70.33 75.56,70.33 v75.56,71.6 | v97.15,71.6 97.15,76.68 98.42,77.95 103.5,77.95 106.04,75.41 103.5,72.87 103.5,65.25 104.77,63.98 106.04,63.98 v106.04,65.25 | v144.14,66.52 145.41,65.25 145.41,52.55 P7.20
  Bottom 0.254: v75.56,71.6 83.18,71.6 84.45,70.33 94.61,70.33 95.88,71.6 v97.15,71.6 | v106.04,65.25 121.28,65.25 122.55,63.98 135.25,63.98 135.25,66.52 v144.14,66.52 | P8.14 154.3,46.2 156.84,48.74 156.84,51.28 146.68,51.28 145.41,52.55 P7.20
  Bottom 0.305: P7.20 P1.20 | IC10.10 RN1.2 66.99,63.98
KI1  (via drill 0.6, 0.61)
  Top 0.254: 57.78,61.44 57.78,74.14 56.51,75.41 v56.51,88.11 | v111.12,93.19 114.3,90.02 114.3,86.21 114.93,85.57 v118.74,85.57 | v121.28,85.57 v121.28,51.28 | v153.03,50.01 153.03,44.93 154.3,43.66 P8.15
  Top 0.305: v58.1,61.44 57.78,61.44
  Bottom 0.254: v56.51,88.11 61.59,88.11 64.13,90.65 73.02,90.65 75.56,93.19 90.8,93.19 91.44,93.83 104.13,93.83 104.77,93.19 v111.12,93.19 | v118.74,85.57 v121.28,85.57 | v121.28,51.28 127.63,51.28 130.17,48.74 | P7.19 v153.03,50.01
  Bottom 0.305: P7.19 P1.19 135.88,50.01 134.62,48.74 130.17,48.74 | IC10.11 RN1.3 v58.1,61.44
KI2  (via drill 0.6, 0.61)
  Top 0.254: v59.69,58.9 59.69,62.71 59.05,62.71 59.05,74.14 57.78,75.41 57.78,88.11 v59.05,90.65 | v73.02,91.92 73.66,92.56 82.55,92.56 83.18,91.92 v83.18,83.03 | v108.58,85.57 108.58,82.4 109.85,81.13 109.85,79.22 113.66,75.41 113.66,47.47 118.42,47.47 121.6,43.03 v121.6,38.58 | v125.41,38.58 125.41,37.31 126.99,37.31 v130.81,41.12 | v154.3,48.74 155.57,47.47 155.57,42.39 154.3,41.12 P8.16
  Bottom 0.254: RN1.4 v59.69,58.9 | v59.05,90.65 61.59,90.65 64.13,91.92 v73.02,91.92 | v83.18,83.03 90.8,83.03 93.34,85.57 v108.58,85.57 | v121.6,38.58 v125.41,38.58 | v154.3,48.74 150.49,48.74 149.22,47.47 P7.18 142.87,47.47 | v130.81,41.12 131.44,41.12
  Bottom 0.305: 142.87,47.47 P1.18 137.16,47.47 136.52,46.84 136.52,42.71 134.93,41.12 131.44,41.12 | IC10.12 RN1.4
KI3  (via drill 0.6, 0.61)
  Top 0.254: v75.56,61.44 75.56,57.63 74.29,56.36 IC10.13 | v90.8,60.17 95.88,55.09 95.88,43.66 98.42,41.12 98.42,29.69 94.61,25.88 v94.61,22.07 | v149.22,43.66 149.22,42.39 150.49,40.49 153.03,40.49 153.03,38.58 154.3,38.58 P8.17
  Top 0.305: v137.16,13.18 137.16,43.98 138.11,44.93 P1.17
  Bottom 0.254: v75.56,61.44 76.83,60.17 v90.8,60.17 | v94.61,22.07 93.34,22.07 93.34,19.53 102.23,14.45 133.98,14.45 | v149.22,43.66 147.95,44.93 P7.17
  Bottom 0.305: P1.17 P7.17 | IC10.13 RN1.5 | 133.98,14.45 135.25,13.18 v137.16,13.18
KI4  (via drill 0.61, 0.7)
  Top 0.254: v81.91,53.82 v81.91,65.25 | v144.14,74.14 146.68,71.6 v146.68,46.2 146.68,43.66 145.41,42.39 P7.16 | v93.34,67.79 93.34,75.41 99.69,83.03 103.5,83.03 v103.5,86.84 | v109.85,86.84 109.85,82.4 111.12,81.13 111.12,79.22 114.93,75.41 118.74,75.41 v120.01,74.14
  Bottom 0.254: v81.91,65.25 84.45,67.79 v93.34,67.79 | v120.01,74.14 v144.14,74.14 | IC10.14 v81.91,53.82 | v103.5,86.84 v109.85,86.84 | v146.68,46.2 153.03,46.2 153.03,44.93 155.57,44.93 155.57,36.04 154.3,34.77 P8.18
  Bottom 0.305: P1.16 P7.16 | IC10.14 RN1.6
KI5  (via drill 0.61)
  Top 0.254: v81.91,51.28 v83.18,52.55 | v93.34,52.55 v93.34,32.23 | v112.39,30.96 120.64,38.9 v120.64,41.12
  Bottom 0.254: v83.18,52.55 v93.34,52.55 | v93.34,32.23 95.88,29.69 108.26,29.69 109.53,30.96 v112.39,30.96 | v120.64,41.12 128.9,41.12 130.17,39.85 131.44,39.85 132.07,40.49 137.16,40.49 137.79,39.85 P1.15 | IC10.15 v81.91,51.28 | P8.19 154.3,32.23 153.03,33.5 153.03,43.66 149.85,43.03 146.68,39.85 P7.15
  Bottom 0.305: P7.15 P1.15 | IC10.15 RN1.7
KI6  (via drill 0.61)
  Top 0.254: v94.61,47.47 v94.61,32.23
  Bottom 0.254: v94.61,47.47 85.72,47.47 84.45,48.74 IC10.16 | v94.61,32.23 104.77,32.23 106.04,33.5 122.55,33.5 124.45,34.77 129.53,34.77 | P8.20 154.3,30.96 153.03,30.96 153.03,32.23 147.95,32.23
  Bottom 0.305: P7.14 P1.14 136.52,37.31 135.88,36.68 135.88,34.77 | 129.53,34.77 135.88,34.77 | IC10.16 RN1.8 | 147.95,32.23 146.68,32.23 145.41,33.5 137.16,33.5 135.88,34.77
KI7  (via drill 0.61)
  Top 0.254: v95.88,42.39 95.88,28.42 93.34,25.88 93.34,20.8 v94.61,20.8 | v150.81,35.09 150.49,34.77 150.49,29.69 153.03,29.69 153.03,28.42 154.3,27.15 | 154.3,27.15 153.03,25.88 v153.03,11.91 | 154.3,27.15 P8.21
  Bottom 0.254: v95.88,42.39 84.45,42.39 81.91,44.93 79.37,44.93 78.1,46.2 IC10.17 | v94.61,20.8 102.23,15.72 146.68,15.72 150.49,11.91 v153.03,11.91 | v150.81,35.09 150.49,34.77 P7.13
  Bottom 0.305: P1.13 P7.13 | IC10.17 RN1.9
KSEL0  (via drill 0.61)
  Top 0.254: v123.5,25.88 123.5,32.23 131.44,32.23 132.71,33.5 IC5.15 | v79.37,29.69 79.37,37.31 80.64,38.58 80.64,66.52 79.37,67.79 79.37,86.84 78.1,86.84 75.56,84.3 IC10.2
  Bottom 0.254: v123.5,25.88 122.87,25.88 120.96,27.79 88.89,27.79 86.99,29.69 v79.37,29.69
KSEL1  (via drill 0.6, 0.61)
  Top 0.254: v124.45,24.61 124.45,29.69 128.9,29.69 128.9,30.96 IC5.14 | v89.53,20.8 88.26,22.07 v88.26,29.69 | v51.43,29.69 51.43,48.74 52.7,50.01 52.7,51.28 52.07,51.92 52.07,53.19 50.8,54.46 50.8,64.62 52.7,66.52 v52.7,71.6 | v64.13,72.87 64.13,75.41 65.4,76.68 65.4,80.49 v66.67,81.76
  Bottom 0.254: v124.45,24.61 123.82,23.34 93.34,23.34 90.8,20.8 v89.53,20.8 | v88.26,29.69 85.72,32.23 76.83,32.23 74.29,29.69 65.4,29.69 64.77,30.33 52.7,30.33 v51.43,29.69 | v52.7,71.6 53.97,72.87 v64.13,72.87
  Bottom 0.305: v66.67,81.76 IC10.3
KSEL2  (via drill 0.61)
  Top 0.254: v128.9,25.88 128.9,28.42 IC5.13 | v92.07,32.23 v92.07,55.09 | v83.18,55.09 v83.18,79.22
  Bottom 0.254: v128.9,25.88 127.63,27.15 122.55,27.15 120.96,28.74 95.56,28.74 v92.07,32.23 | v92.07,55.09 v83.18,55.09 | v83.18,79.22 81.91,80.49 75.56,80.49 74.29,79.22 IC10.4
KSEL3  (via drill 0.61)
  Top 0.254: v108.58,32.55 108.58,65.89 v105.41,69.06 | v110.48,69.06 110.48,77.32 108.58,79.22 v108.58,80.49
  Bottom 0.254: v105.41,69.06 v110.48,69.06 | v108.58,80.49 85.72,80.49 83.18,77.95 75.56,77.95 74.29,76.68 IC10.5 | IC5.12 132.71,25.88 128.9,29.69 122.55,29.69 120.01,32.55 v108.58,32.55
N$1  (via drill 0.61)
  Top 0.254: v59.69,11.91 59.69,16.99 60.32,18.26 IC3.12 | v75.56,11.6 IC4.3
  Bottom 0.254: v59.69,11.91 65.08,11.91 66.35,10.64 67.3,10.64 68.57,11.91 75.24,11.91 v75.56,11.6
N$3
  Bottom 0.254: R6.1 50.16,18.26 IC3.3
N$4  (via drill 0.61)
  Top 0.254: v93.66,9.37 95.88,6.83 BEEP1.1
  Bottom 0.254: R6.2 53.97,6.83 67.94,6.83 70.48,9.37 v93.66,9.37
N$5
  Top 0.254: D1.C IC9.21
N$6  (via drill 0.6)
  Top 0.254: v56.83,8.1 56.83,14.13 57.78,15.09 57.78,19.85 58.73,20.8 58.73,25.56 57.46,26.83 57.46,30.65 58.41,31.6 58.41,32.87 59.05,33.5 59.05,37.63 58.41,38.26 58.41,41.44 56.83,43.03 v56.83,46.2 | JP6.3 66.35,76.68 65.4,75.73 65.4,72.56 64.13,71.28 v64.13,46.2
  Bottom 0.254: IC3.8 v56.83,8.1 | v56.83,46.2 v64.13,46.2
N$15  (via drill 0.61)
  Top 0.254: v73.02,22.07 IC12.13
  Bottom 0.254: v73.02,22.07 69.21,22.07 66.67,19.53 59.05,19.53 56.51,16.99 51.43,16.99 51.43,14.45 59.05,14.45 60.32,15.72 IC3.11
N$17  (via drill 0.61, 0.7)
  Top 0.254: v59.05,29.06 59.05,32.23 59.69,32.87 59.69,37.95 59.05,38.58 59.05,43.03 58.1,43.98 58.1,49.69 55.24,52.55 55.24,53.19 53.97,54.46 v53.97,58.9 | v85.72,30.96 IC12.8
  Top 0.305: v57.78,58.9 57.78,60.17 56.51,61.44 56.51,74.14 55.24,75.41 55.24,84.3 53.97,85.57 JP3.1
  Bottom 0.254: v85.72,30.96 76.83,30.96 74.92,29.06 v59.05,29.06
  Bottom 0.305: v53.97,58.9 v57.78,58.9
N$19  (via drill 0.61)
  Top 0.254: v80.64,36.04 IC12.10
  Bottom 0.254: JP4.2 v80.64,36.04
N$32
  Bottom 0.254: IC1.5 37.46,10.64 36.19,11.91 JP1.2
N$33
  Top 0.254: IC2.15 29.84,18.26 32.38,15.72 32.38,14.45 JP1.1
N$34
  Bottom 0.254: IC2.7 22.22,5.56 26.03,9.37 JP1.3
NDAC
  Bottom 0.254: 145.41,84.3 144.14,85.57 135.88,85.57 135.25,84.94 128.27,84.94 127.63,85.57 126.36,85.57 125.09,86.84 IC6.10 | 154.3,84.3 P2.8
  Bottom 0.406: 145.41,84.3 154.3,84.3
NDACIN  (via drill 0.61)
  Top 0.254: v34.92,66.52 v34.92,74.14 | v59.05,75.41 59.05,85.57 60.32,86.84 60.32,88.11 61.59,89.38 61.59,95.73 v62.86,97 | v118.74,95.73 118.74,89.38 120.01,88.11 IC6.9
  Bottom 0.254: v34.92,74.14 36.19,75.41 v59.05,75.41 | v62.86,97 116.83,97 118.1,95.73 v118.74,95.73 | IC9.10 v34.92,66.52
NDACOUT  (via drill 0.61)
  Top 0.254: v127.63,84.3 IC6.11
  Bottom 0.254: IC11.39 v127.63,84.3
NRFD  (via drill 0.61, 0.7)
  Top 0.254: v123.82,36.04 123.82,41.12 128.9,41.12 128.9,44.62 128.58,45.25 128.58,48.11 128.9,48.74 v128.9,76.68 | IC12.12 v75.56,32.23 | IC6.14 135.25,83.03 v136.52,81.76
  Top 0.305: v134.62,76.68 135.25,76.68 135.88,77.32 135.88,81.13 v136.52,81.76
  Bottom 0.254: v75.56,32.23 76.83,33.5 89.53,33.5 92.07,36.04 v123.82,36.04 | P2.7 154.3,81.76 v136.52,81.76
  Bottom 0.305: v128.9,76.68 v134.62,76.68
NRFDIN  (via drill 0.61, 0.7)
  Top 0.254: v53.34,52.55 53.34,53.19 52.07,54.46 v52.07,62.71 | v90.8,62.71 v90.8,76.68 | v94.61,79.22 94.61,88.11 v97.15,90.65 | v107.94,90.02 111.12,90.02 112.39,88.75 112.39,84.3 113.66,83.03 118.74,83.03 120.01,84.3 120.01,85.57 121.28,86.84 122.55,85.57 123.82,86.84 127.63,83.03 128.9,84.3
  Top 0.305: v128.9,86.21 128.9,84.3
  Bottom 0.254: v53.34,52.55 31.11,52.55 29.84,51.28 IC9.16 | v52.07,62.71 v90.8,62.71 | v90.8,76.68 93.34,79.22 v94.61,79.22 | v97.15,90.65 97.78,91.29 101.59,91.29 102.23,90.65 106.67,90.65 107.31,90.02 v107.94,90.02
  Bottom 0.305: IC6.15 137.79,87.48 136.52,86.21 v128.9,86.21
NRFDOUT  (via drill 0.61)
  Top 0.254: v50.16,67.79 v50.16,82.4 | v75.56,85.57 v75.56,91.29 | v131.44,93.19 132.71,89.38 IC6.13
  Bottom 0.254: v50.16,67.79 41.27,67.79 37.46,63.98 IC9.11 | v50.16,82.4 51.43,82.4 51.75,82.08 64.13,82.08 67.62,85.57 v75.56,85.57 | v75.56,91.29 76.83,92.56 91.44,92.56 92.07,93.19 103.5,93.19 104.13,92.56 110.48,92.56 111.12,91.92 111.75,91.92 113.02,93.19 123.82,93.19 124.45,93.83 125.72,93.83 126.99,92.56 v131.44,93.19
PHI2  (via drill 0.61)
  Top 0.254: v34.92,75.41 36.19,74.14 v36.19,51.28
  Bottom 0.254: IC11.25 113.66,48.74 112.39,47.47 98.42,47.47 97.15,48.74 IC10.25 86.99,48.74 85.72,50.01 60.32,50.01 59.05,51.28 IC9.25 v36.19,51.28 | P4.C26 12.06,75.41 v34.92,75.41
R/-W  (via drill 0.61)
  Top 0.254: v83.18,42.39 v83.18,38.58 | v17.77,70.33 17.77,68.43 18.41,67.79 18.41,63.98 18.41,51.28 v19.68,50.01 | v36.19,50.01 v36.19,46.2
  Bottom 0.254: IC11.21 107.31,38.58 106.04,39.85 98.42,39.85 97.15,38.58 IC10.21 v83.18,38.58 | v83.18,42.39 70.48,42.39 69.21,43.66 IC9.22 38.73,43.66 v36.19,46.2 | v17.77,70.33 15.87,70.33 14.6,71.6 P4.C25 | v19.68,50.01 v36.19,50.01
SHIELD  (via drill 0.61)
  Top 0.254: R3.2 141.6,70.33 141.6,83.03 151.76,93.19 v151.76,94.46
  Bottom 0.254: v151.76,94.46 154.3,94.46 P2.12
UP0
  Bottom 0.254: P3.C IC9.2
UP1
  Bottom 0.254: P3.D IC9.3
UP2
  Bottom 0.254: P3.E IC9.4
UP3
  Bottom 0.254: P3.F IC9.5
UP4
  Bottom 0.254: P3.H IC9.6
UP5
  Bottom 0.254: P3.J IC9.7
UP6
  Bottom 0.254: P3.K IC9.8
UP7
  Bottom 0.254: P3.L IC9.9
UPCA1
  Bottom 0.254: P3.B 24.76,89.38 26.03,90.65 41.27,90.65 42.54,89.38 IC9.40
UPCB2/BEEP  (via drill 0.61)
  Top 0.254: v22.22,43.66 20.95,44.93 20.95,65.25 P3.M | IC3.1 52.7,23.34 51.43,22.07 51.43,9.37 48.89,6.83 26.03,6.83 26.03,22.07 27.3,23.34 27.3,38.58 26.03,39.85 26.03,42.39 27.3,43.66 IC9.19
  Bottom 0.254: IC9.19 v22.22,43.66
VCC  (via drill 0.6, 0.61, 0.7)
  Top 0.305: IC5.16 134.62,36.04 136.2,34.45 136.2,12.87 137.16,11.91 P1.4
  Top 0.406: C11.1 IC2.16
  Top 0.813: C9.1 IC3.14 62.86,23.34 64.13,22.07 v64.13,14.45 64.13,12.55 63.81,11.91 63.81,9.69 64.13,9.05 R4.2 64.13,1.75 76.83,1.75 80.64,5.56 IC4.5 | P4.C2 P4.C3 12.06,15.72 13.33,16.99 v13.33,38.58 | IC1.6 40,8.1 43.81,11.91 43.81,19.53 45.08,20.8 IC1.16 C10.1 v46.35,27.15 v46.35,37.31 46.35,47.47 45.08,48.74 | 45.08,48.74 46.35,50.01 46.35,66.52 47.62,67.79 47.62,77.95 48.89,79.22 v48.89,85.57 48.89,93.83 47.62,95.1 P5.2 | 45.08,48.74 IC9.24 | C3.2 137.79,84.3 140.33,86.84 IC6.16 | C5.2 IC11.20 102.23,38.58 103.5,39.85 v103.5,42.39 | v147.95,61.44 R1.2 | IC7.16 131.44,60.17 130.17,61.44 v130.17,61.76 130.17,81.76 131.44,83.03 IC8.16 131.44,84.3 131.44,90.02 130.81,90.65 v129.53,90.65 | IC9.20 29.84,41.12 31.11,39.85 C7.1 31.11,27.15 C11.1 | IC11.22 117.47,41.12 118.74,42.39 118.74,44.93 117.47,46.2 IC11.24 | IC10.22 89.53,41.12 90.8,42.39 90.8,44.93 89.53,46.2 IC10.24 | C6.2 IC10.20 | C8.1 66.67,28.42 67.94,29.69 v67.94,34.77 66.67,36.04 66.67,41.44 62.23,45.89 v62.23,66.52 62.23,78.27 62.86,78.9 v62.86,85.57 | v122.55,61.76 v122.55,46.2
  Bottom 0.61: 13.33,11.91 31.11,11.91 31.11,10.64 36.19,10.64 36.19,8.1 IC1.6 | 131.44,37.31 132.39,37.31 133.34,38.26 C4.2
  Bottom 0.813: IC12.14 C8.1 C9.1 60.32,25.88 50.16,25.88 48.89,27.15 v46.35,27.15 31.11,27.15 C11.1 | IC4.14 C13.1 v64.13,14.45 | C12.+ 13.33,11.91 13.33,13.18 P4.C2 | v48.89,85.57 v62.86,85.57 64.13,86.84 64.77,86.84 66.67,88.75 77.46,88.75 79.37,90.65 93.34,90.65 94.61,89.38 106.67,89.38 107.31,88.75 108.58,88.75 109.21,89.38 117.47,89.38 118.74,90.65 123.19,90.65 123.82,90.34 126.36,90.34 126.99,90.65 v129.53,90.65 | IC3.14 60.32,23.34 59.05,22.07 48.89,22.07 47.62,20.8 IC1.16 | IC6.16 C2.2 | IC8.16 C3.2 | IC7.16 133.98,60.17 135.25,61.44 C1.2 v147.95,61.44 | IC11.20 106.04,38.58 107.31,37.31 131.44,37.31 132.71,36.04 IC5.16 | 27.3,37.31 R7.1 | 27.3,37.31 C7.1 32.38,38.58 38.73,38.58 40,37.31 v46.35,37.31 P6.2 55.24,37.31 56.51,34.77 57.15,34.14 62.86,34.14 63.5,34.77 v67.94,34.77 C6.2 | IC10.20 76.83,38.58 80.64,41.12 IC10.22 97.15,41.12 98.42,42.39 v103.5,42.39 104.77,41.12 IC11.22 | v13.33,38.58 26.03,38.58 27.3,37.31 | RN1.1 v62.23,66.52 | v130.17,61.76 v122.55,61.76 | IC11.24 v122.55,46.2
VDRIVE  (via drill 0.61)
  Top 0.254: v81.91,43.66 81.91,22.07 83.18,20.8 IC12.6 | R7.2 v32.38,53.82 | v24.76,53.82 v24.76,70.33 | v69.21,31.6 69.21,41.44 71.75,43.66 IC10.18
  Bottom 0.254: IC10.18 v81.91,43.66 | v32.38,53.82 IC9.15 v24.76,53.82 | P3.9 20.95,70.33 v24.76,70.33 | R7.2 44.45,32.23 45.72,31.6 v69.21,31.6
VSYNC  (via drill 0.7)
  Top 0.254: IC12.5 80.64,18.26 81.91,16.99 81.91,13.18 84.45,10.64 84.45,4.29 86.99,1.75 95.88,1.75 v98.42,4.29 | JP2.2 156.84,60.17 156.84,1.75 122.55,1.75 v120.01,5.56
  Bottom 0.254: v98.42,4.29 100.96,6.83 118.74,6.83 v120.01,5.56

## Text on the board
Top: CSA-PETIO-V1.2B | (C) A. Fachat
tNames: CSA-PETIO-V1.2B | (C) A. Fachat | C64 | PET